# EAGLE schematic TriggerTone (EAGLE 9.6.1)
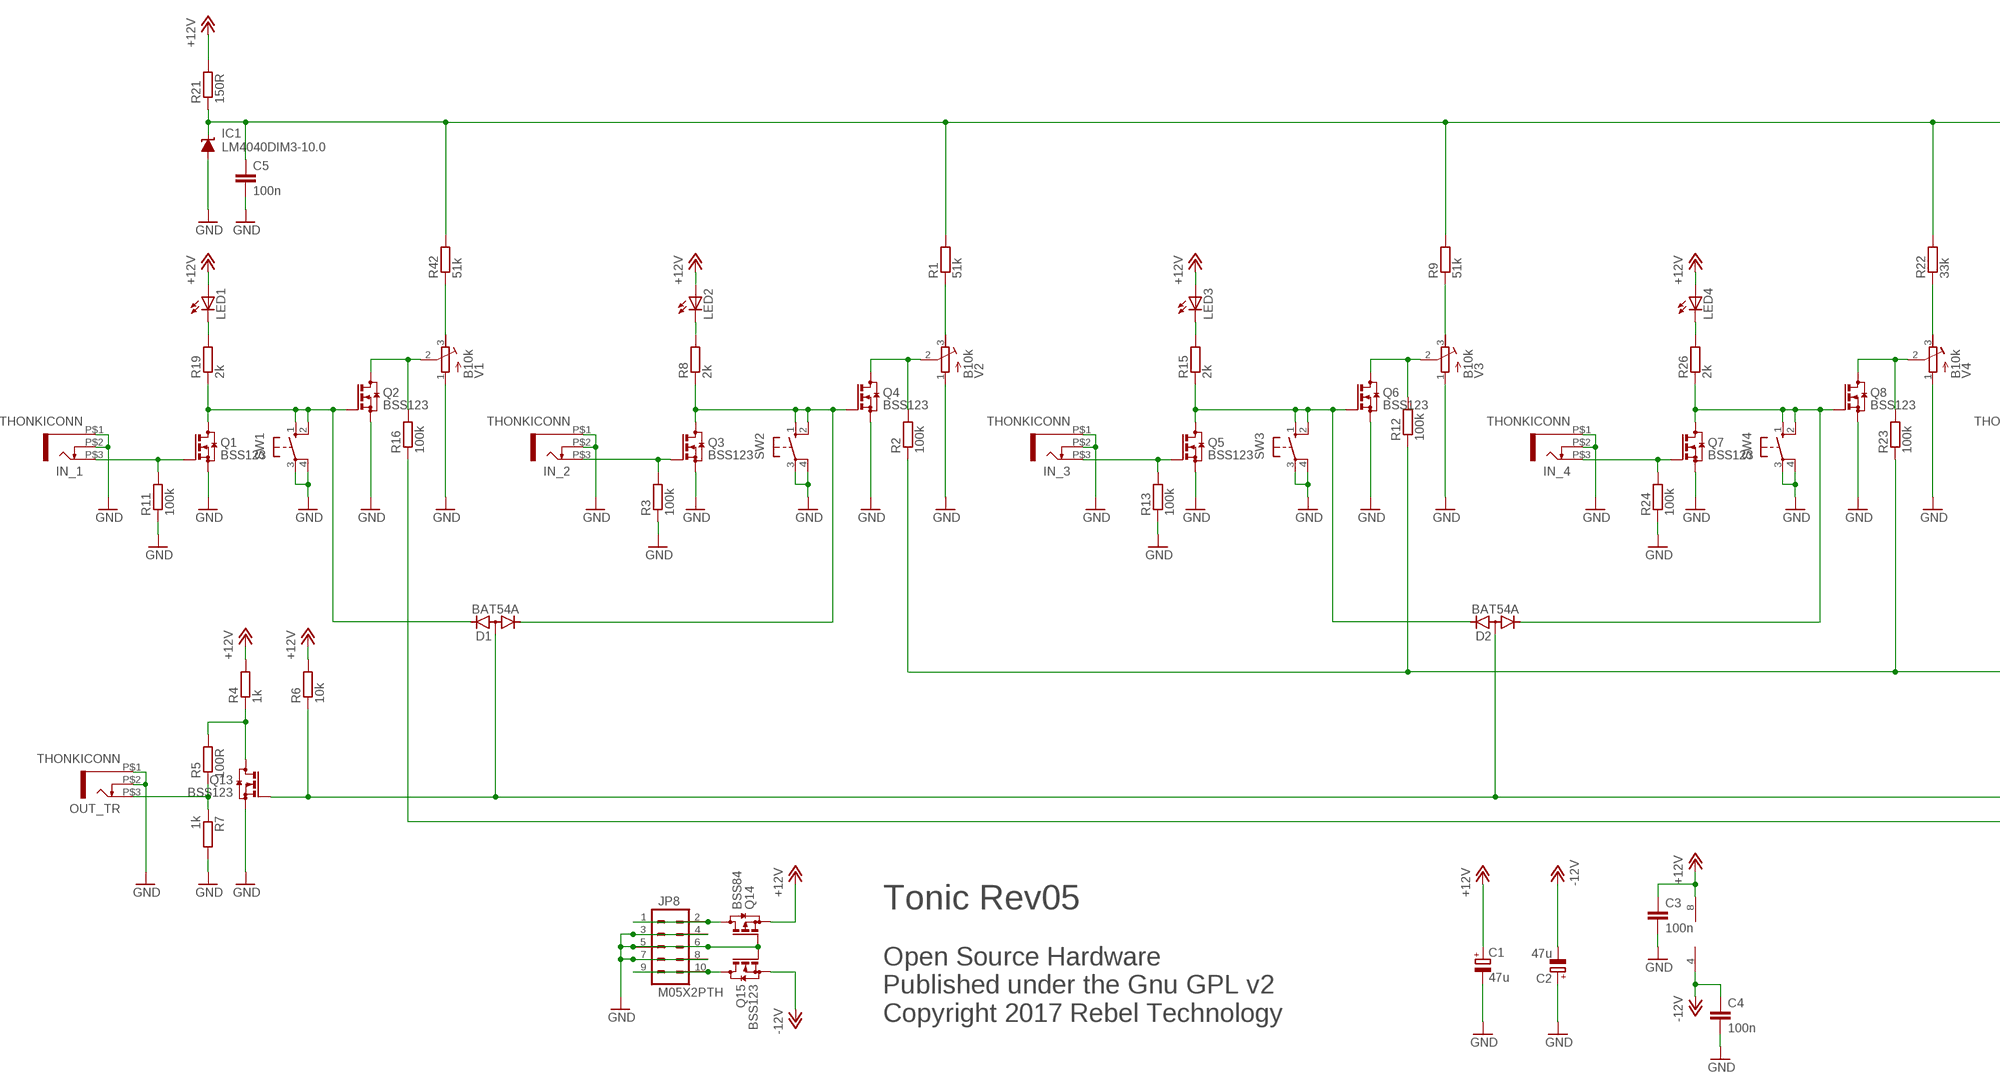
[diagram p0: schematic, sheet 1, part 1 of 2]
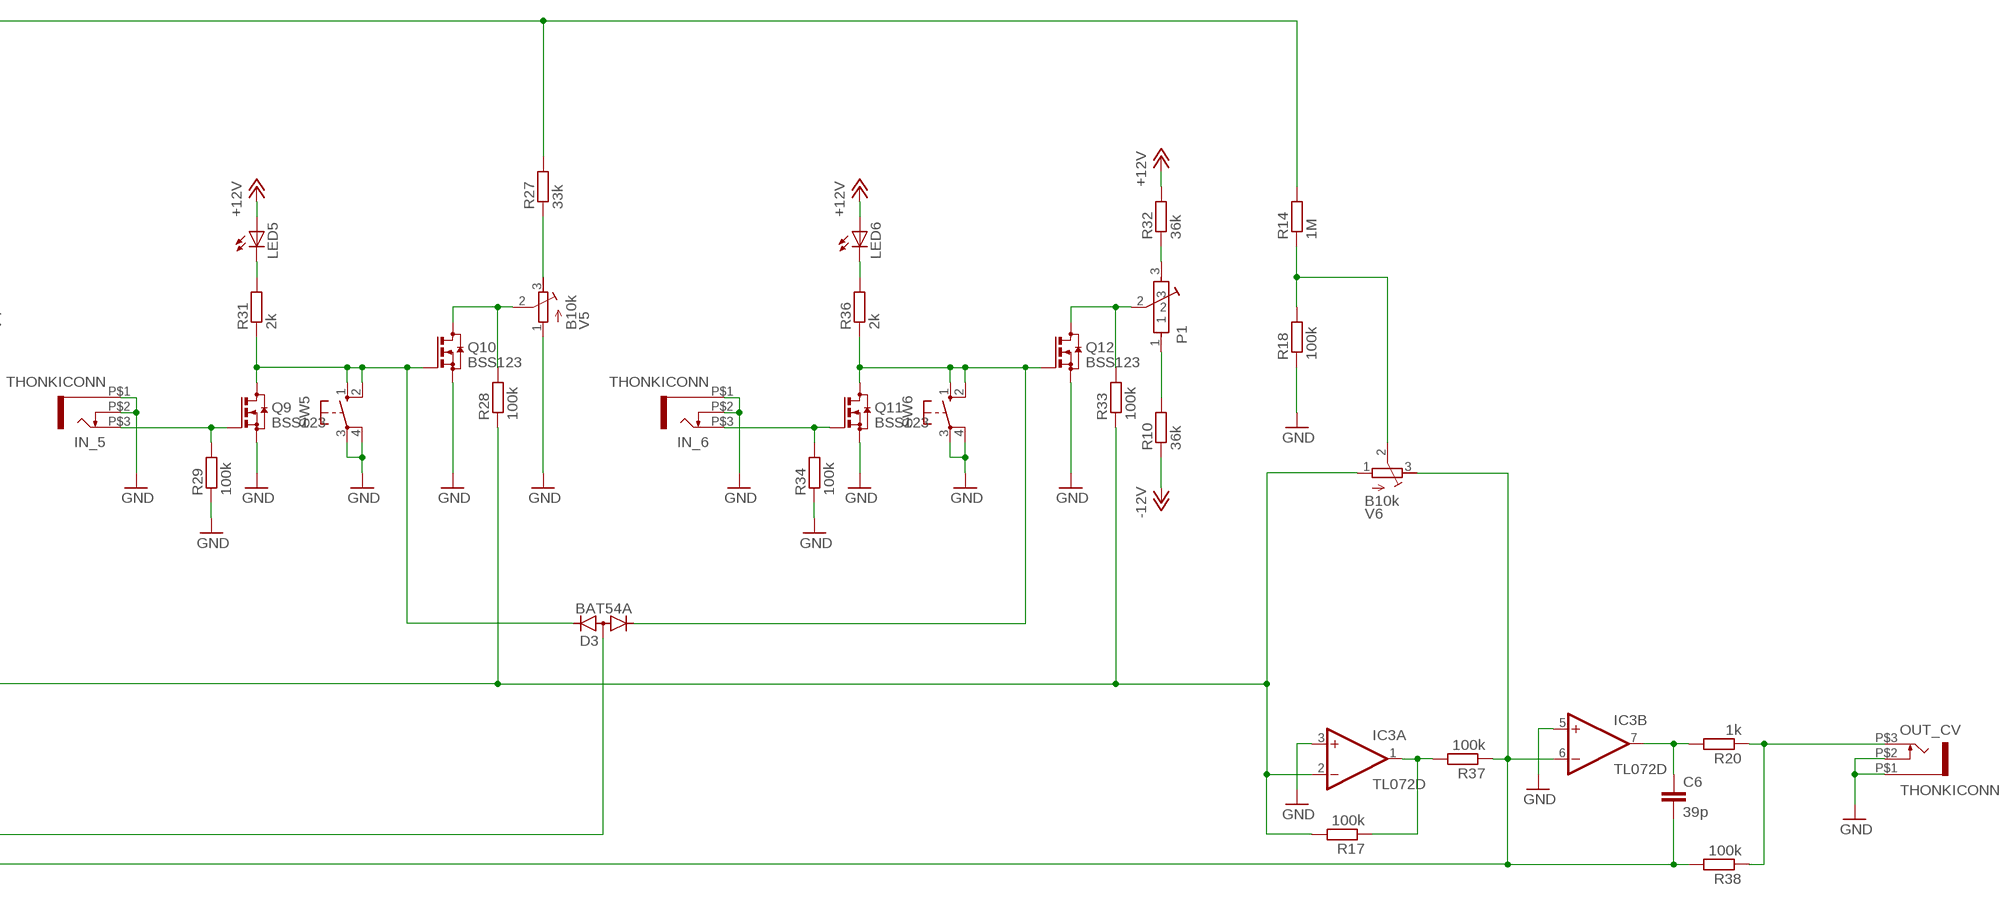
[diagram p1: schematic, sheet 1, part 2 of 2]

## Parts
C1  47u  CPOL-EU153CLV-0505  [CPOL-5]
C2  47u  CPOL-EU153CLV-0505  [CPOL-5]
C3  100n  C-EUC0603  [C0603]
C4  100n  C-EUC0603  [C0603]
C5  100n  C-EUC0603  [C0603]
C6  39p  C-EUC0603  [C0603]
D1  BAT54A  DIODE-2CA|ACSOT23  [SOT23]
D2  BAT54A  DIODE-2CA|ACSOT23  [SOT23]
D3  BAT54A  DIODE-2CA|ACSOT23  [SOT23]
IC1  LM4040DIM3-10.0  LM4041A12DBZ  [DBZ_R-PDSO-G3]
IC3  TL072D  [SO08]
IN_1  THONKICONN  [THONKICONN]
IN_2  THONKICONN  [THONKICONN]
IN_3  THONKICONN  [THONKICONN]
IN_4  THONKICONN  [THONKICONN]
IN_5  THONKICONN  [THONKICONN]
IN_6  THONKICONN  [THONKICONN]
JP8  M05X2PTH  [AVR_ICSP]
LED1  LED3MM  [LED3MM]
LED2  LED3MM  [LED3MM]
LED3  LED3MM  [LED3MM]
LED4  LED3MM  [LED3MM]
LED5  LED3MM  [LED3MM]
LED6  LED3MM  [LED3MM]
OUT_CV  THONKICONN  [THONKICONN]
OUT_TR  THONKICONN  [THONKICONN]
P1  POT-ALPS-RK09L1140  [POT-ALPS-RK09L1140]
Q1  BSS123  [SOT23]
Q2  BSS123  [SOT23]
Q3  BSS123  [SOT23]
Q4  BSS123  [SOT23]
Q5  BSS123  [SOT23]
Q6  BSS123  [SOT23]
Q7  BSS123  [SOT23]
Q8  BSS123  [SOT23]
Q9  BSS123  [SOT23]
Q10  BSS123  [SOT23]
Q11  BSS123  [SOT23]
Q12  BSS123  [SOT23]
Q13  BSS123  [SOT23]
Q14  BSS84  [SOT23]
Q15  BSS123  [SOT23]
R1  51k  R-EU_0603  [0603]
R2  100k  R-EU_0603  [0603]
R3  100k  R-EU_0603  [0603]
R4  1k  R-EU_0603  [0603]
R5  100R  R-EU_0603  [0603]
R6  10k  R-EU_0603  [0603]
R7  1k  R-EU_0603  [0603]
R8  2k  R-EU_0603  [0603]
R9  51k  R-EU_0603  [0603]
R10  36k  R-EU_0603  [0603]
R11  100k  R-EU_0603  [0603]
R12  100k  R-EU_0603  [0603]
R13  100k  R-EU_0603  [0603]
R14  1M  R-EU_0603  [0603]
R15  2k  R-EU_0603  [0603]
R16  100k  R-EU_0603  [0603]
R17  100k  R-EU_0603  [0603]
R18  100k  R-EU_0603  [0603]
R19  2k  R-EU_0603  [0603]
R20  1k  R-EU_0603  [0603]
R21  150R  R-EU_0603  [0603]
R22  33k  R-EU_0603  [0603]
R23  100k  R-EU_0603  [0603]
R24  100k  R-EU_0603  [0603]
R26  2k  R-EU_0603  [0603]
R27  33k  R-EU_0603  [0603]
R28  100k  R-EU_0603  [0603]
R29  100k  R-EU_0603  [0603]
R31  2k  R-EU_0603  [0603]
R32  36k  R-EU_0603  [0603]
R33  100k  R-EU_0603  [0603]
R34  100k  R-EU_0603  [0603]
R36  2k  R-EU_0603  [0603]
R37  100k  R-EU_0603  [0603]
R38  100k  R-EU_0603  [0603]
R42  51k  R-EU_0603  [0603]
SW1  10-XX  [B3F-10XX]
SW2  10-XX  [B3F-10XX]
SW3  10-XX  [B3F-10XX]
SW4  10-XX  [B3F-10XX]
SW5  10-XX  [B3F-10XX]
SW6  10-XX  [B3F-10XX]
V1  B10k  R-TRIMM3296W  [RTRIM3296W]
V2  B10k  R-TRIMM3296W  [RTRIM3296W]
V3  B10k  R-TRIMM3296W  [RTRIM3296W]
V4  B10k  R-TRIMM3296W  [RTRIM3296W]
V5  B10k  R-TRIMM3296W  [RTRIM3296W]
V6  B10k  R-TRIMM3296W  [RTRIM3296W]

## Nets
+12V: C1.+ C3.1 IC3.8(P:V+) LED1.A LED2.A LED3.A LED4.A LED5.A LED6.A Q14.2(S) R4.2 R6.2 R21.2 R32.2
-12V: C2.- C4.1 IC3.4(P:V-) Q15.2(S) R10.1
GND: C1.- C2.+ C3.2 C4.2 C5.2 IC1.2(A) IC3.3(A:+IN) IC3.5(B:+IN) IN_1.P$1 IN_1.P$2 IN_2.P$1 IN_2.P$2 IN_3.P$1 IN_3.P$2 IN_4.P$1 IN_4.P$2 IN_5.P$1 IN_5.P$2 IN_6.P$1 IN_6.P$2 JP8.3 JP8.4 JP8.5 JP8.6 JP8.7 JP8.8 OUT_CV.P$1 OUT_CV.P$2 OUT_TR.P$1 OUT_TR.P$2 Q1.2(S) Q2.2(S) Q3.2(S) Q4.2(S) Q5.2(S) Q6.2(S) Q7.2(S) Q8.2(S) Q9.2(S) Q10.2(S) Q11.2(S) Q12.2(S) Q13.2(S) Q14.1(G) Q15.1(G) R3.1 R7.2 R11.1 R13.1 R18.1 R24.1 R29.1 R34.1 SW1.3(P) SW1.4(P1) SW2.3(P) SW2.4(P1) SW3.3(P) SW3.4(P1) SW4.3(P) SW4.4(P1) SW5.3(P) SW5.4(P1) SW6.3(P) SW6.4(P1) V1.1(A) V2.1(A) V3.1(A) V4.1(A) V5.1(A)
N$1: LED1.K(C) R19.2
N$2: OUT_CV.P$3 R20.1 R38.1
N$3: IN_1.P$3 Q1.1(G) R11.2
N$4: JP8.9 JP8.10 Q15.3(D)
N$5: R1.1 V2.3(E)
N$6: OUT_TR.P$3 R5.1 R7.1
N$7: Q2.3(D) R16.2 V1.2(S)
N$8: LED3.K(C) R15.2
N$9: LED4.K(C) R26.2
N$10: LED5.K(C) R31.2
N$11: LED6.K(C) R36.2
N$13: IN_2.P$3 Q3.1(G) R3.2
N$14: LED2.K(C) R8.2
N$15: Q13.3(D) R4.1 R5.2
N$16: D1.1(K1) Q3.3(D) Q4.1(G) R8.1 SW2.1(S) SW2.2(S1)
N$18: Q4.3(D) R2.2 V2.2(S)
N$19: C5.1 IC1.1(C) R1.2 R9.2 R14.2 R21.1 R22.2 R27.2 R42.2
N$21: P1.3 R32.1
N$22: D1.3(A) D2.3(A) D3.3(A) Q13.1(G) R6.1
N$23: R9.1 V3.3(E)
N$24: P1.1 R10.2
N$25: D1.2(K2) Q1.3(D) Q2.1(G) R19.1 SW1.1(S) SW1.2(S1)
N$27: R14.1 R18.2 V6.2(S)
N$28: D2.2(K2) Q5.3(D) Q6.1(G) R15.1 SW3.1(S) SW3.2(S1)
N$29: IN_3.P$3 Q5.1(G) R13.2
N$30: Q6.3(D) R12.2 V3.2(S)
N$32: R22.1 V4.3(E)
N$33: C6.1 IC3.7(B:OUT) R20.2
N$35: IC3.1(A:OUT) R17.1 R37.2
N$37: D2.1(K1) Q7.3(D) Q8.1(G) R26.1 SW4.1(S) SW4.2(S1)
N$38: IN_4.P$3 Q7.1(G) R24.2
N$39: Q8.3(D) R23.2 V4.2(S)
N$43: R27.1 V5.3(E)
N$44: R42.1 V1.3(E)
N$46: D3.2(K2) Q9.3(D) Q10.1(G) R31.1 SW5.1(S) SW5.2(S1)
N$49: IN_5.P$3 Q9.1(G) R29.2
N$50: Q10.3(D) R28.2 V5.2(S)
N$54: D3.1(K1) Q11.3(D) Q12.1(G) R36.1 SW6.1(S) SW6.2(S1)
N$55: IN_6.P$3 Q11.1(G) R34.2
N$56: P1.2 Q12.3(D) R33.2
N$79: JP8.1 JP8.2 Q14.3(D)
NEG: C6.2 IC3.6(B:-IN) R16.1 R37.1 R38.2 V6.3(E)
POS: IC3.2(A:-IN) R2.1 R12.1 R17.2 R23.1 R28.1 R33.1 V6.1(A)
Unconnected: P1.P$5 P1.P$6

## Notes on the sheet
- Tonic Rev05
- Open Source Hardware
  Published under the Gnu GPL v2
  Copyright 2017 Rebel Technology

## Library data of the parts
C1 C2 = Rebel:CPOL-EU: POLARIZED CAPACITOR, European symbol
C3-C6 = Rebel:C-EU: CAPACITOR, European symbol
D1-D3 = diode:DIODE-2CA|AC: Dual DIODE Cathode-Anode|Anode-Cathode
IC1 = texas:LM4041: PRECISION MICROPOWER SHUNT VOLTAGE REFERENCE Source: http://focus.ti.com/lit/ds/slcs146e/slcs146e.pdf; MPN: LM4041A12IDBZR; OC_FARNELL: 1407949; OC_NEWARK: 58K5875
IC3 = linear:TL072: OP AMP
IN_1-IN_6 OUT_CV OUT_TR = Rebel:THONKICONN
JP8 = SparkFun:M05X2: Header 5x2 Standard 10-pin dual row 0.1" header. Commonly used with AVR-ISP. Use with Spark Fun Electronics SKU: PRT-00778
LED1-LED6 = Rebel:LED: LED
P1 = Rebel:POT-ALPS-RK09L
Q1-Q13 = transistor-small-signal:BSS123: N-CHANNEL MOS FET
Q14 = transistor-small-signal:BSS84: P-CHANNEL MOS FET; OC_FARNELL: 1779264
Q15 = transistor-small-signal:BSS123: N-CHANNEL MOS FET; OC_FARNELL: 1843725
R1-R24 R26-R29 R31-R34 R36-R38 R42 = Rebel:R-EU_: RESISTOR, European symbol
SW1-SW6 = switch-omron:10-XX: OMRON SWITCH; MPN: B3F-1000; OC_FARNELL: 176432; OC_NEWARK: 36M3542
V1-V6 = resistor:R-TRIMM: Trimm resistor

## Module TRIGGER
Ports: TR_IN(io)

### Library data of the parts